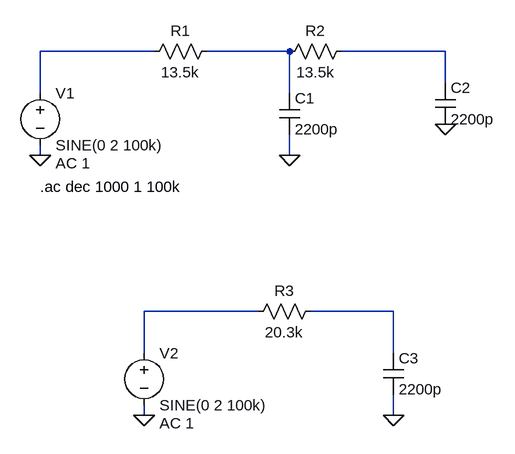
[diagram p0: schematic low_pass.asc]
low_pass.asc, the LTspice schematic file:
Version 4
SHEET 1 880 680
WIRE 96 16 -80 16
WIRE 304 16 176 16
WIRE 544 16 384 16
WIRE 544 64 544 16
WIRE -80 80 -80 16
WIRE 304 80 304 16
WIRE -80 176 -80 160
WIRE 304 176 304 144
WIRE 256 416 80 416
WIRE 464 416 336 416
WIRE 80 480 80 416
WIRE 464 480 464 416
WIRE 80 576 80 560
WIRE 464 576 464 544
FLAG -80 176 0
FLAG 304 176 0
FLAG 544 128 0
FLAG 80 576 0
FLAG 464 576 0
SYMBOL voltage -80 64 R0
WINDOW 123 24 124 Left 2
WINDOW 39 0 0 Left 0
SYMATTR Value2 AC 1
SYMATTR InstName V1
SYMATTR Value SINE(0 2 100k)
SYMBOL res 192 0 R90
WINDOW 0 0 56 VBottom 2
WINDOW 3 32 56 VTop 2
SYMATTR InstName R1
SYMATTR Value 13.5k
SYMBOL cap 288 80 R0
SYMATTR InstName C1
SYMATTR Value 2200p
SYMBOL res 400 0 R90
WINDOW 0 0 56 VBottom 2
WINDOW 3 32 56 VTop 2
SYMATTR InstName R2
SYMATTR Value 13.5k
SYMBOL cap 528 64 R0
SYMATTR InstName C2
SYMATTR Value 2200p
SYMBOL voltage 80 464 R0
WINDOW 123 24 124 Left 2
WINDOW 39 0 0 Left 0
SYMATTR Value2 AC 1
SYMATTR InstName V2
SYMATTR Value SINE(0 2 100k)
SYMBOL res 352 400 R90
WINDOW 0 0 56 VBottom 2
WINDOW 3 32 56 VTop 2
SYMATTR InstName R3
SYMATTR Value 20.3k
SYMBOL cap 448 480 R0
SYMATTR InstName C3
SYMATTR Value 2200p
TEXT -80 224 Left 2 !.ac dec 1000 1 100k

The netlist it stands for:
* low_pass.asc
V1 N001 0 SINE(0 2 100k) AC 1
R1 N002 N001 13.5k
C1 N002 0 2200p
R2 N003 N002 13.5k
C2 N003 0 2200p
V2 N004 0 SINE(0 2 100k) AC 1
R3 N005 N004 20.3k
C3 N005 0 2200p
.ac dec 1000 1 100k
.backanno
.end